# EasyEDA Pro project ProPrj_承载我所有幻想的键盘_2025-02-09.epro, schematic 12-Schematic
Create Date: 2024-03-26; Page Name: P1; Project Name: 火星号键盘V2; Schematic Name: Schematic5; Update Date: 2024-06-23; Company: 嘉立创EDA; Page Size: A4; Version: V1.0
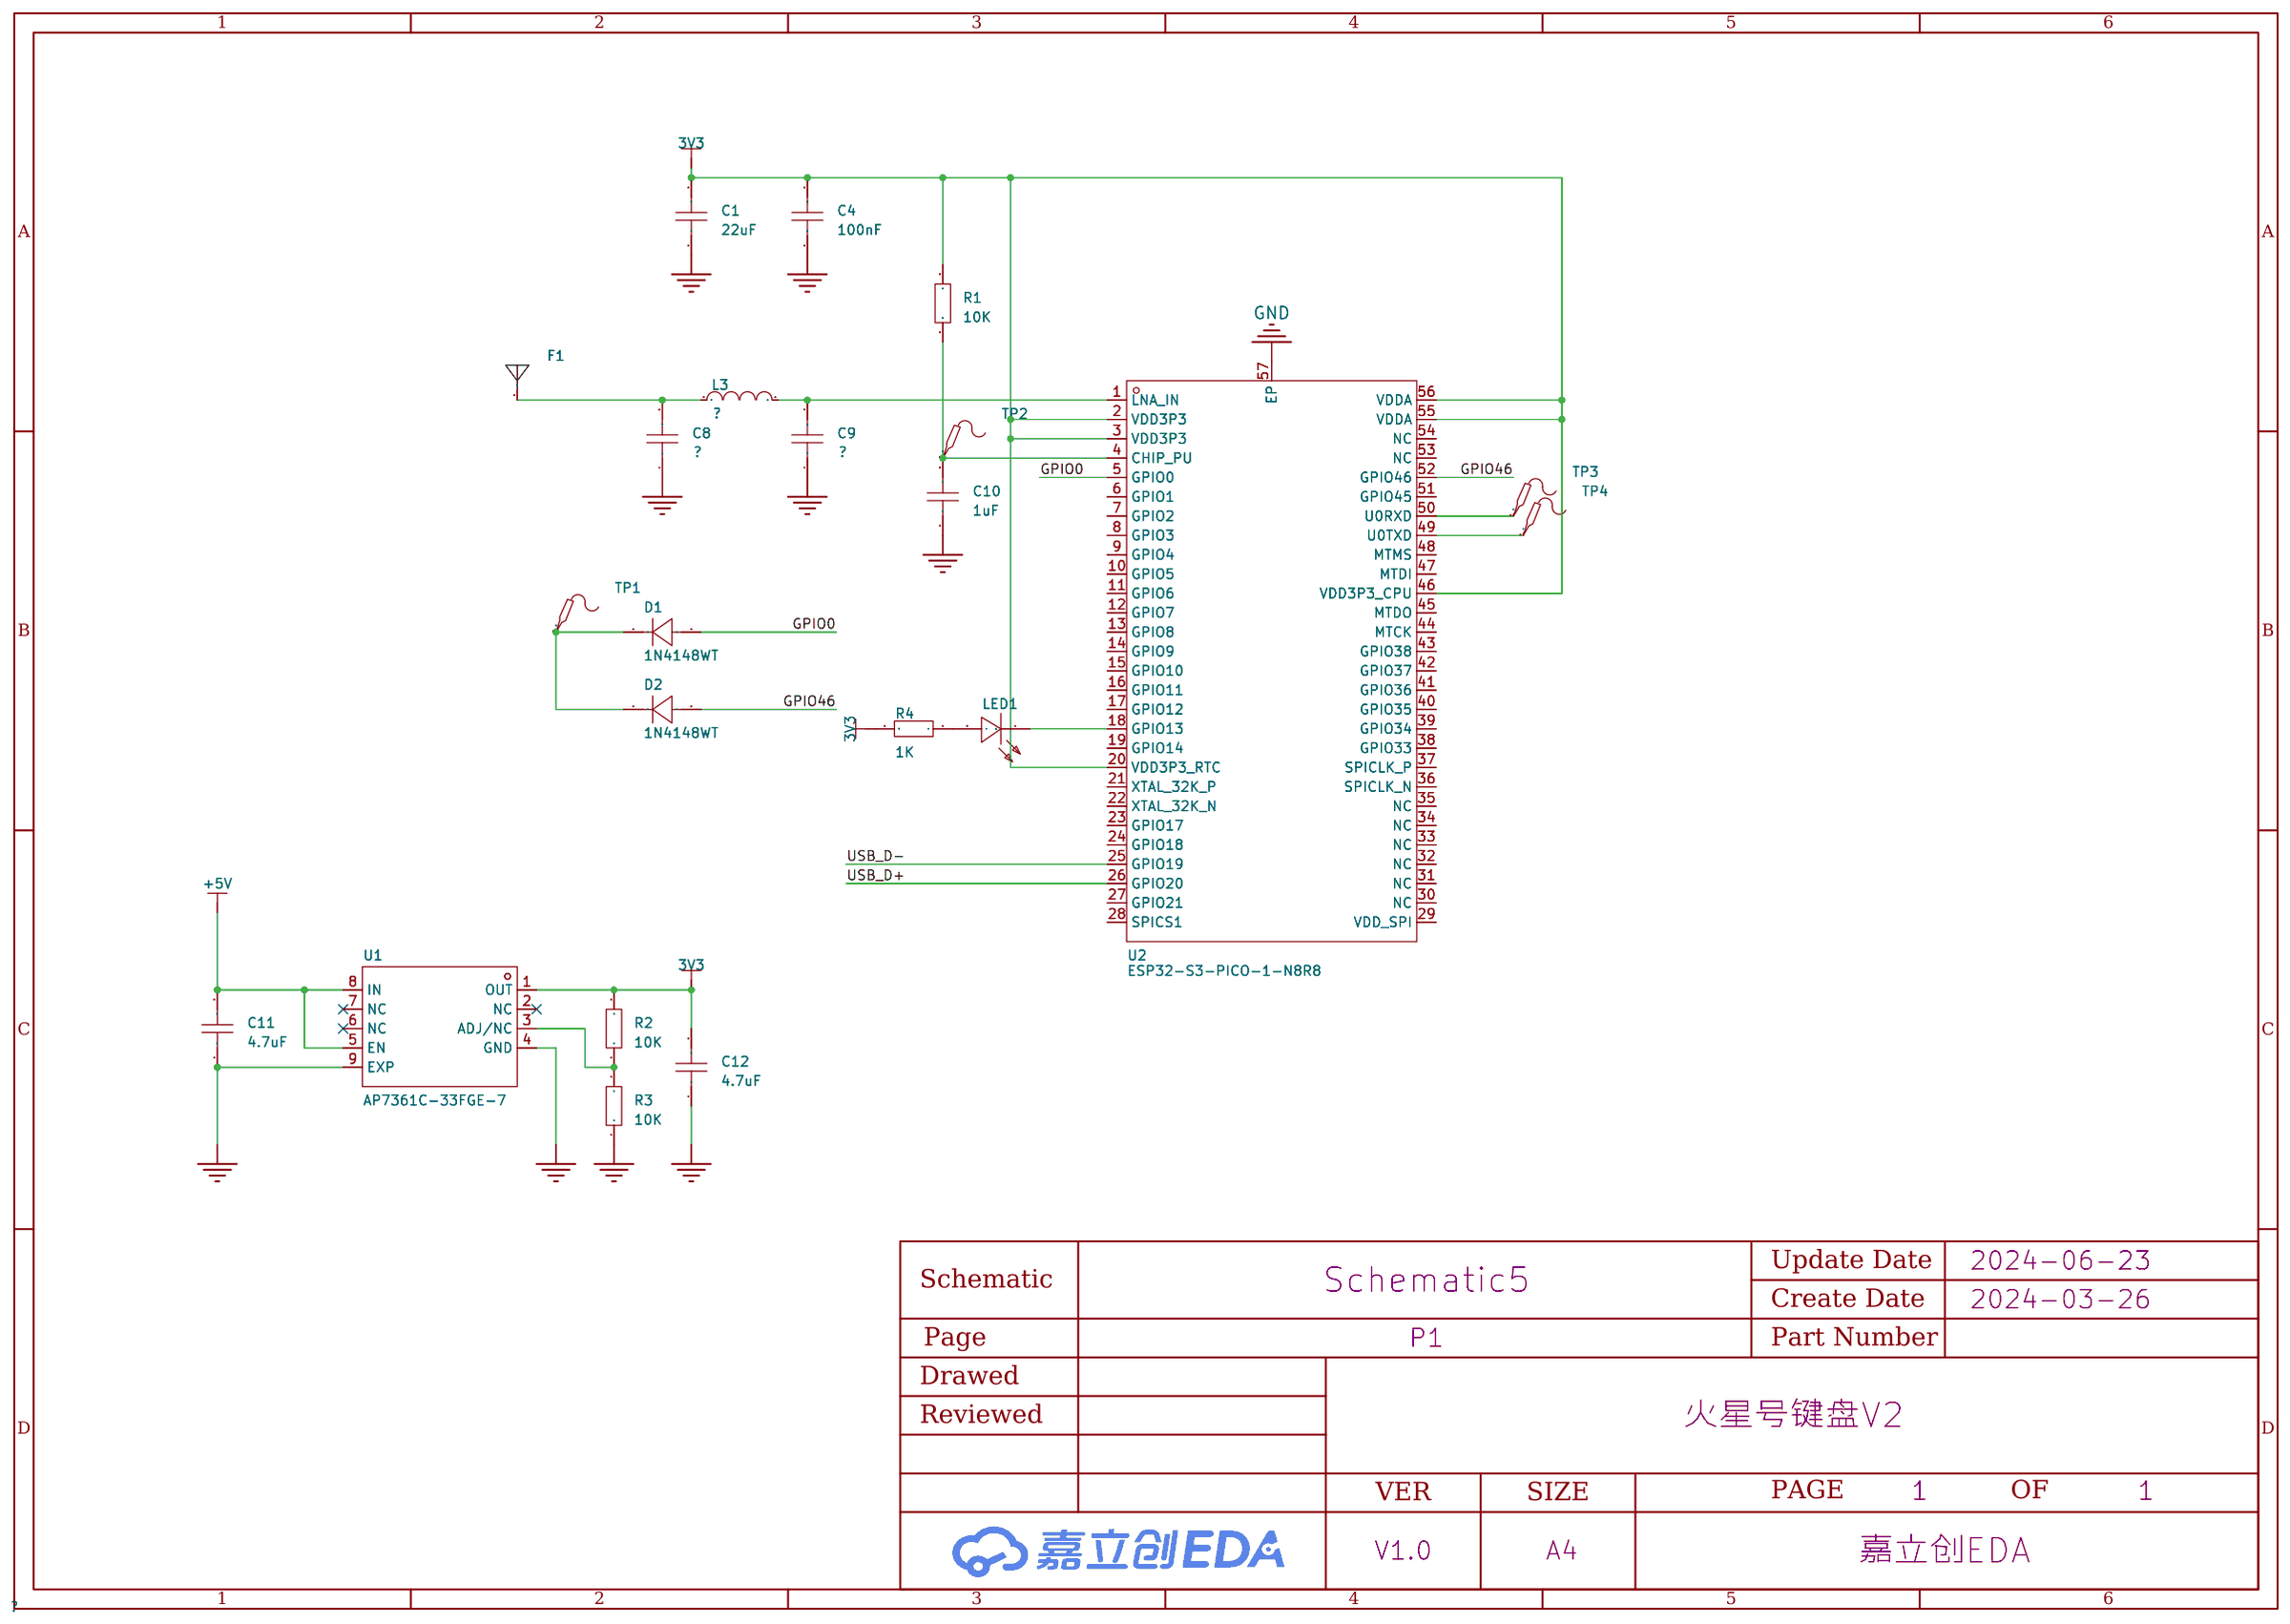
[diagram p25: schematic sheet]

## Parts
C1  22uF  [C0402]
C4  100nF  [C0201]
C8  ？  [C0201]
C9  ？  [C0201]
C10  1uF  [C0603]
C11  4.7uF  [C0402]
C12  4.7uF  [C0402]
D1  1N4148WT  [SOD-523F_L1.2-W0.8-LS1.7-RD]
D2  1N4148WT  [SOD-523F_L1.2-W0.8-LS1.7-RD]
F1  -  [天线]
L3  ？  [L0201]
LED1  99-218GLM2C/L7277SGU/TR8-T/ES  [LED-SMD_L3.8-W1.0-RD_WHITE]
R1  10K  [R0402]
R2  10K  [R0402]
R3  10K  [R0402]
R4  1K  [R0402]
TP1  -  [Test-Point-0.5mm]
TP2  -  [Test-Point-0.5mm]
TP3  -  [Test-Point-0.5mm]
TP4  -  [Test-Point-0.5mm]
U1  AP7361C-33FGE-7  [DFN-8_L3.0-W3.0-P0.65-BL-EP]
U2  ESP32-S3-PICO-1-N8R8  [QFN-56_L7.0-W7.0-P0.40-TL-EP4.0]

## Library data of the parts
C1 C11 C12 = CL05A106MP5NUNC: 容值:10uF;精度:±20%;额定电压:10V;材质(温度系数):X5R;; LCSC Part Name: 10uF ±20% 10V; Supplier Part: C315248; Manufacturer: SAMSUNG(三星); Supplier Footprint: 0402; JLCPCB Part Class: Extended Part; Datasheet: https://atta.szlcsc.com/upload/public/pdf/source/20200102/C478861_C4302703595930F3C0E62DAD3349F1AA.pdf; Supplier: LCSC; Tolerance: ±20%; Voltage Rated: 10V; Temperature Coefficient: X5R
C4 = 0402B104J250NT: 容值:100nF;精度:±5%;额定电压:25V;材质(温度系数):X7R;; LCSC Part Name: 100nF ±5% 25V; Supplier Part: C301928; Manufacturer: FH(风华); Supplier Footprint: 0402; JLCPCB Part Class: Extended Part; Datasheet: https://atta.szlcsc.com/upload/public/pdf/source/20181030/C301928_67246FA88671EF9CE9E8BBAF8F7C8A47.pdf; Supplier: LCSC; Tolerance: ±5%; Voltage Rated: 25V; Temperature Coefficient: X7R
C8 C9 = GRM033R61A104KE15D: 容值:100nF;精度:±10%;额定电压:10V;材质(温度系数):X5R;; LCSC Part Name: 100nF ±10% 10V; Supplier Part: C76934; Manufacturer: muRata(村田); Supplier Footprint: 0201; JLCPCB Part Class: Extended Part; Datasheet: https://atta.szlcsc.com/upload/public/pdf/source/20180307/C76934_15204090982891407723.pdf; Supplier: LCSC; Tolerance: ±10%; Voltage Rated: 10V; Temperature Coefficient: X5R
C10 = CAP_0603: Supplier Footprint: 0603
D1 D2 = 1N4148WT: 二极管配置:-;正向压降(Vf):-;直流反向耐压(Vr):-;平均整流电流(Io):-;反向恢复时间(trr):-;; Supplier Part: C499644; Manufacturer: GP(格瑞宝); Supplier Footprint: SOD-523; JLCPCB Part Class: 扩展库; Datasheet: https://atta.szlcsc.com/upload/public/pdf/source/20240402/B143BF8F522A64FF25DE886FC6F69F29.pdf; Supplier: LCSC
F1 = wifi天线
L3 = LQP03TQ9N1H02D: 电感值:9.1nH;精度:±3%;额定电流:250mA;饱和电流(Isat):-;直流电阻(DCR):650mΩ;; LCSC Part Name: 9.1nH ±3%; Supplier Part: C237373; Manufacturer: muRata(村田); Supplier Footprint: 0201; JLCPCB Part Class: Extended Part; Datasheet: https://atta.szlcsc.com/upload/public/pdf/source/20190906/C426324_E625012984D9CF3790F7AD1737FAB225.pdf; Supplier: LCSC; Tolerance: ±3%; Rated Current: 250mA; DC Resistance (DCR): 650mΩ; Q @ Freq: 17@500MHz; Frequency - Self Resonant: 4.5GHz
LED1 = 99-218GLM2C/L7277SGU/TR8-T/ES: 发光颜色:白色;功率:110mW;正向电流:20mA;主波长:-;二极管配置:-;透镜颜色:无色透明透镜;色温:-;发光角度:120°;载带方式:侧贴;工作温度:-40℃~+85℃;; LCSC Part Name: 白灯 侧贴; Supplier Part: C605463; Manufacturer: EVERLIGHT(亿光); Supplier Footprint: SMD,0.9x3.8mm; JLCPCB Part Class: 扩展库; Datasheet: https://atta.szlcsc.com/upload/public/pdf/source/20200615/C605463_C5D40F8DCCF498815177E62077382238.pdf; Supplier: LCSC; Emitted Color: 白色; Power Dissipation: 110mW; Forward Current: 20mA; Lens Color: 无色透明透镜; Viewing Angle: 120°; Mounting Sytle: 侧贴; Operating Temperature: -40℃~+85℃
R1-R4 = Res_0402: Supplier Footprint: 0402
TP1-TP4 = Test-Point: Test Point 测试点
U1 = AP7361C-33FGE-7: 输出类型:固定;输出极性:正;最大输入电压:6V;输出电压:3.3V;输出电流:1A;电源纹波抑制比(PSRR):75dB;; Supplier: LCSC; Manufacturer: DIODES(美台); Supplier Part: C151007; JLCPCB Part Class: 扩展库; LCSC Part Name: 输入6V 输出3.3V 1A; Supplier Footprint: DFN-8(3x3); Datasheet: https://atta.szlcsc.com/upload/public/pdf/source/20191127/C460398_C880E058EAEAB5A3EBAEF0C50E6863E1.pdf; Output Type: 固定; Output Polarity: 正; Number of Outputs: 1; Maximum Input Voltage: 6V; Output Voltage: 3.3V; Dropout Voltage: 360mV@(1A); Output Current: 1A; Power Supply Rejection Ratio (PSRR): 75dB
U2 = ESP32-S3-PICO-1-N8R8_C7545129: Supplier Part: C7545129; Supplier Footprint: LGA56_7X7; JLCPCB Part Class: 扩展库; Supplier: LCSC

## Nets
3V3: C1.2 C4.1 C12.2 R1.2 R2.2 R4.2 U1.1(OUT) U2.2(VDD3P3) U2.3(VDD3P3) U2.20(VDD3P3_RTC) U2.46(VDD3P3_CPU) U2.55(VDDA) U2.56(VDDA)
+5V: C11.2 U1.5(EN) U1.8(IN)
GND: C1.1 C4.2 C8.1 C9.1 C10.1 C11.1 C12.1 R3.1 U1.4(GND) U1.9(EXP) U2.57(EP)
GPIO0: D1.2(A) U2.5(GPIO0)
GPIO46: D2.2(A) U2.52(GPIO46)
USB_D+: U2.26(GPIO20)
USB_D-: U2.25(GPIO19)
$1N1239: C9.2 L3.2 U2.1(LNA_IN)
$1N1243: C8.2 F1.1 L3.1
$1N1633: C10.2 R1.1 TP2.1 U2.4(CHIP_PU)
$1N2072: D1.1(K) D2.1(K) TP1.1
$1N2138: TP3.1 U2.50(U0RXD)
$1N2141: TP4.1 U2.49(U0TXD)
$1N2335: R2.1 R3.2 U1.3(ADJ/NC)
$1N2645: LED1.1(C) U2.18(GPIO13)
$1N2722: LED1.2(A) R4.1

Not connected (* = marked no-connect by the designer): U1 2(NC)* 6(NC)* 7(NC)*; U2 6(GPIO1) 7(GPIO2) 8(GPIO3) 9(GPIO4) 10(GPIO5) 11(GPIO6) 12(GPIO7) 13(GPIO8) 14(GPIO9) 15(GPIO10) 16(GPIO11) 17(GPIO12) 19(GPIO14) 21(XTAL_32K_P) 22(XTAL_32K_N) 23(GPIO17) 24(GPIO18) 27(GPIO21) 28(SPICS1) 29(VDD_SPI) 30(NC) 31(NC) 32(NC) 33(NC) 34(NC) 35(NC) 36(SPICLK_N) 37(SPICLK_P) 38(GPIO33) 39(GPIO34) 40(GPIO35) 41(GPIO36) 42(GPIO37) 43(GPIO38) 44(MTCK) 45(MTDO) 47(MTDI) 48(MTMS) 51(GPIO45) 53(NC) 54(NC)
